# Altium schematic sheet pcb_heater.SchDoc
size A4; SheetNumber: 1; SheetTotal: 1
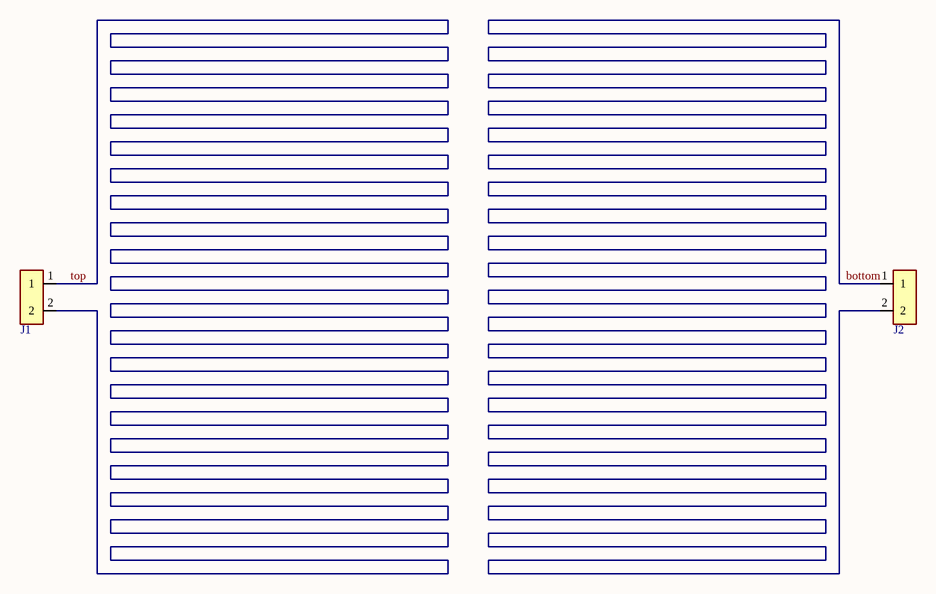
[diagram p0: pcb_heater.SchDoc]

## Parts
J1  Connector, PCB heater  [pcb_heater_connector]  (value not drawn)
J2  Connector, PCB heater  [pcb_heater_connector]  (value not drawn)

## Nets
bottom: J2.1 J2.2
top: J1.1 J1.2